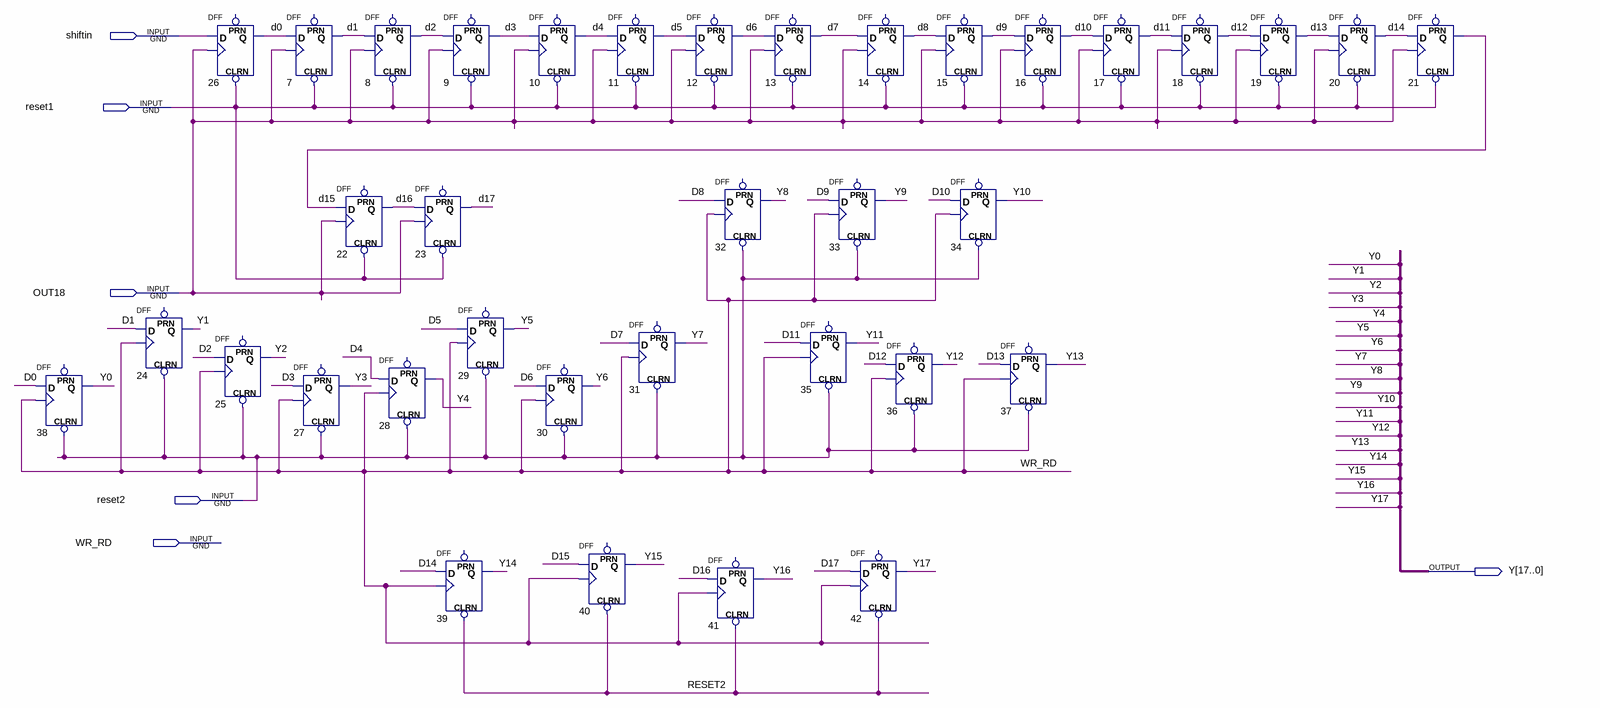
[diagram p0: schematic sheet]
// Quartus schematic shift18_par18.bdf as structural Verilog: 36 symbols, 6 pins
module shift18_par18 (
  input  shiftin,
  input  reset1,
  input  OUT18,
  input  reset2,
  input  WR_RD,
  output [17:0] Y
);

  wire D0, D1, D2, D3, D4, D5, D6, D7, D8, D9, D10, D11, D12, D13, D14, D15, D16, D17;

  DFF u_38 (.CLRN(reset2), .CLK(WR_RD), .D(D0), .Q(Y[0]));  // open: PRN
  DFF u_24 (.CLRN(reset2), .CLK(WR_RD), .D(D1), .Q(Y[1]));  // open: PRN
  DFF u_26 (.CLRN(reset1), .CLK(OUT18), .D(shiftin), .Q(D0));  // open: PRN
  DFF u_25 (.CLRN(reset2), .CLK(WR_RD), .D(D2), .Q(Y[2]));  // open: PRN
  DFF u_7 (.CLRN(reset1), .CLK(OUT18), .D(D0), .Q(D1));  // open: PRN
  DFF u_27 (.CLRN(reset2), .CLK(WR_RD), .D(D3), .Q(Y[3]));  // open: PRN
  DFF u_22 (.CLRN(reset1), .CLK(OUT18), .D(D15), .Q(D16));  // open: PRN
  DFF u_8 (.CLRN(reset1), .CLK(OUT18), .D(D1), .Q(D2));  // open: PRN
  DFF u_23 (.CLRN(reset1), .CLK(OUT18), .D(D16), .Q(D17));  // open: PRN
  DFF u_28 (.CLRN(reset2), .CLK(WR_RD), .D(D4), .Q(Y[4]));  // open: PRN
  DFF u_9 (.CLRN(reset1), .CLK(OUT18), .D(D2), .Q(D3));  // open: PRN
  DFF u_29 (.CLRN(reset2), .CLK(WR_RD), .D(D5), .Q(Y[5]));  // open: PRN
  DFF u_39 (.CLRN(reset2), .CLK(WR_RD), .D(D14), .Q(Y[14]));  // open: PRN
  DFF u_10 (.CLRN(reset1), .CLK(OUT18), .D(D3), .Q(D4));  // open: PRN
  DFF u_30 (.CLRN(reset2), .CLK(WR_RD), .D(D6), .Q(Y[6]));  // open: PRN
  DFF u_40 (.CLRN(reset2), .CLK(WR_RD), .D(D15), .Q(Y[15]));  // open: PRN
  DFF u_11 (.CLRN(reset1), .CLK(OUT18), .D(D4), .Q(D5));  // open: PRN
  DFF u_31 (.CLRN(reset2), .CLK(WR_RD), .D(D7), .Q(Y[7]));  // open: PRN
  DFF u_12 (.CLRN(reset1), .CLK(OUT18), .D(D5), .Q(D6));  // open: PRN
  DFF u_32 (.CLRN(reset2), .CLK(WR_RD), .D(D8), .Q(Y[8]));  // open: PRN
  DFF u_41 (.CLRN(reset2), .CLK(WR_RD), .D(D16), .Q(Y[16]));  // open: PRN
  DFF u_13 (.CLRN(reset1), .CLK(OUT18), .D(D6), .Q(D7));  // open: PRN
  DFF u_35 (.CLRN(reset2), .CLK(WR_RD), .D(D11), .Q(Y[11]));  // open: PRN
  DFF u_14 (.CLRN(reset1), .CLK(OUT18), .D(D7), .Q(D8));  // open: PRN
  DFF u_33 (.CLRN(reset2), .CLK(WR_RD), .D(D9), .Q(Y[9]));  // open: PRN
  DFF u_42 (.CLRN(reset2), .CLK(WR_RD), .D(D17), .Q(Y[17]));  // open: PRN
  DFF u_36 (.CLRN(reset2), .CLK(WR_RD), .D(D12), .Q(Y[12]));  // open: PRN
  DFF u_15 (.CLRN(reset1), .CLK(OUT18), .D(D8), .Q(D9));  // open: PRN
  DFF u_34 (.CLRN(reset2), .CLK(WR_RD), .D(D10), .Q(Y[10]));  // open: PRN
  DFF u_16 (.CLRN(reset1), .CLK(OUT18), .D(D9), .Q(D10));  // open: PRN
  DFF u_37 (.CLRN(reset2), .CLK(WR_RD), .D(D13), .Q(Y[13]));  // open: PRN
  DFF u_17 (.CLRN(reset1), .CLK(OUT18), .D(D10), .Q(D11));  // open: PRN
  DFF u_18 (.CLRN(reset1), .CLK(OUT18), .D(D11), .Q(D12));  // open: PRN
  DFF u_19 (.CLRN(reset1), .CLK(OUT18), .D(D12), .Q(D13));  // open: PRN
  DFF u_20 (.CLRN(reset1), .CLK(OUT18), .D(D13), .Q(D14));  // open: PRN
  DFF u_21 (.CLRN(reset1), .CLK(OUT18), .D(D14), .Q(D15));  // open: PRN
endmodule
